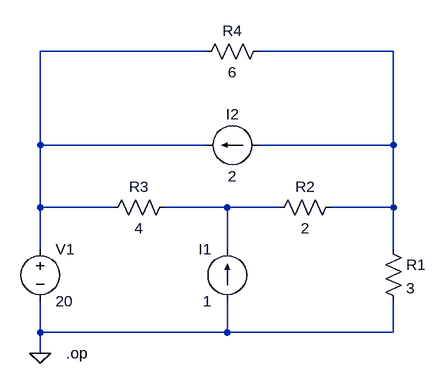
[diagram p0: schematic CH03-KP3-07.asc]
CH03-KP3-07.asc, the LTspice schematic file:
Version 4
SHEET 1 880 680
WIRE 256 64 0 64
WIRE 544 64 336 64
WIRE 0 208 0 64
WIRE 256 208 0 208
WIRE 544 208 544 64
WIRE 544 208 336 208
WIRE 0 304 0 208
WIRE 112 304 0 304
WIRE 288 304 192 304
WIRE 368 304 288 304
WIRE 544 304 544 208
WIRE 544 304 448 304
WIRE 0 368 0 304
WIRE 288 368 288 304
WIRE 544 368 544 304
WIRE 0 496 0 448
WIRE 288 496 288 448
WIRE 288 496 0 496
WIRE 544 496 544 448
WIRE 544 496 288 496
WIRE 0 528 0 496
FLAG 0 528 0
DATAFLAG 544 304 "$"
SYMBOL res 528 352 R0
SYMATTR InstName R1
SYMATTR Value 3
SYMBOL res 464 288 R90
WINDOW 0 0 56 VBottom 2
WINDOW 3 32 56 VTop 2
SYMATTR InstName R2
SYMATTR Value 2
SYMBOL res 208 288 R90
WINDOW 0 0 56 VBottom 2
WINDOW 3 32 56 VTop 2
SYMATTR InstName R3
SYMATTR Value 4
SYMBOL res 352 48 R90
WINDOW 0 0 56 VBottom 2
WINDOW 3 32 56 VTop 2
SYMATTR InstName R4
SYMATTR Value 6
SYMBOL current 288 448 R180
WINDOW 0 24 80 Left 2
WINDOW 3 24 0 Left 2
SYMATTR InstName I1
SYMATTR Value 1
SYMBOL current 336 208 R90
WINDOW 0 -32 40 VBottom 2
WINDOW 3 32 40 VTop 2
SYMATTR InstName I2
SYMATTR Value 2
SYMBOL voltage 0 352 R0
SYMATTR InstName V1
SYMATTR Value 20
TEXT 40 528 Left 2 !.op

The netlist it stands for:
* CH03-KP3-07.asc
R1 N002 0 3
R2 N002 N003 2
R3 N003 N001 4
R4 N002 N001 6
I1 0 N003 1
I2 N002 N001 2
V1 N001 0 20
.op
.backanno
.end